# Altium schematic sheet USB.SchDoc
size A3; SheetNumber: 3; SheetTotal: 5
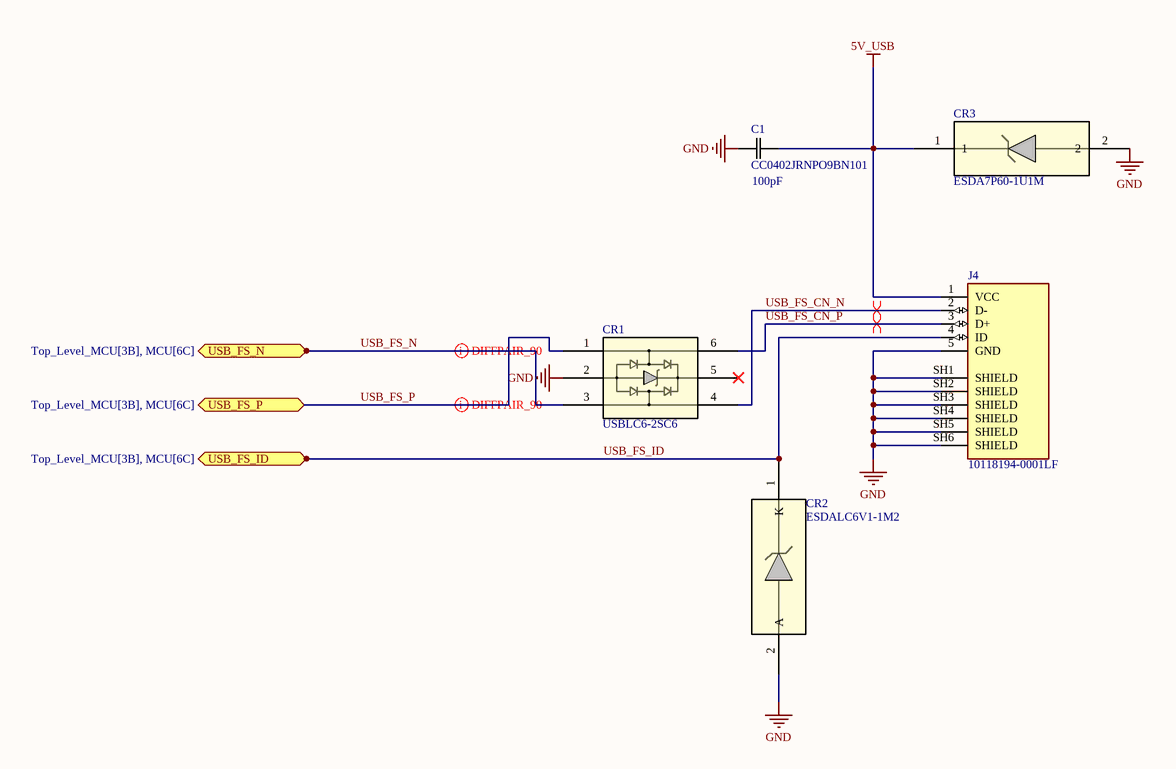
[diagram p0: USB.SchDoc]

## Parts
C1  CC0402JRNPO9BN101  [CAP_CC0402_YAG]
CR1  USBLC6-2SC6  [SOT23-6L_STM]
CR2  ESDALC6V1-1M2  [SOD882_STM]
CR3  ESDA7P60-1U1M  [ZDO_1610_STM]
J4  10118194-0001LF  [AMPHENOL_10118194-0001LF]

## Ports
USB_FS_ID (bidir, see Top_Level_MCU[3B], MCU[6C]), USB_FS_N (bidir, see Top_Level_MCU[3B], MCU[6C]), USB_FS_P (bidir, see Top_Level_MCU[3B], MCU[6C])

## Nets
5V_USB: C1.2 CR3.1 J4.1(VCC)
GND: C1.1 CR1.2 CR2.2(A) CR3.2 J4.5(GND) J4.SH1(SHIELD) J4.SH2(SHIELD) J4.SH3(SHIELD) J4.SH4(SHIELD) J4.SH5(SHIELD) J4.SH6(SHIELD)
USB_FS_CN_N: CR1.4 J4.2(D-)
USB_FS_CN_P: CR1.6 J4.3(D+)
USB_FS_ID: CR2.1(K) J4.4(ID) ; port USB_FS_ID
USB_FS_N: CR1.3 ; port USB_FS_N
USB_FS_P: CR1.1 ; port USB_FS_P

Not connected (* = marked no-connect by the designer): CR1 5*

## Layout directives
differential pair: USB_FS_CN_N, USB_FS_CN_P, USB_FS_N, USB_FS_P

## Notes on the sheet
- (near C1) 100pF

## Library data of the parts
C1 = CC0402JRNPO9BN101: CAPACITOR; SMT (0402); CERAMIC CHIP; 100PF; 50V; TOL=5%; TG=-55 DEGC TO +125 DEGC; TC=C0G; Manufacturer_Name: Yageo; Copyright: Copyright (C) 2025 Ultra Librarian. All rights reserved.; Manufacturer_Part_Number: CC0402JRNPO9BN101
CR1 = USBLC6-2SC6: ESD Protection for USB 2.0 High Speed; Manufacturer_Name: STMicroelectronics; Copyright: Copyright (C) 2025 Ultra Librarian. All rights reserved.; Manufacturer_Part_Number: USBLC6-2SC6; RefDes: RefDes; Type: Type
CR2 = ESDALC6V1-1M2: Single line low capacitance Transil&#8482;, transient surge voltage suppressor (TVS) for ESD protection; Manufacturer_Name: STMicroelectronics; Copyright: Copyright (C) 2025 Ultra Librarian. All rights reserved.; Manufacturer_Part_Number: ESDALC6V1-1M2; RefDes: RefDes; Type: Type
CR3 = ESDA7P60-1U1M: 60 A - 8/20 us, 5 V TVS in QFN-2L; Manufacturer_Name: STMicroelectronics; Copyright: Copyright (C) 2025 Ultra Librarian. All rights reserved.; Manufacturer_Part_Number: ESDA7P60-1U1M; RefDes: RefDes; Type: Type
J4 = 10118194-0001LF: Micro USB, Input Output Connectors, B TYPE RECEPTACLE with flange; MF: Amphenol ICC; SnapEDA_Link: https://www.snapeda.com/parts/10118194-0001LF/Amphenol+FCI/view-part/?ref=snap; Package: None; Value: *; MP: 10118194-0001LF; Check_prices: https://www.snapeda.com/parts/10118194-0001LF/Amphenol+FCI/view-part/?ref=eda